# EAGLE design Connector (EAGLE 9.6.2)
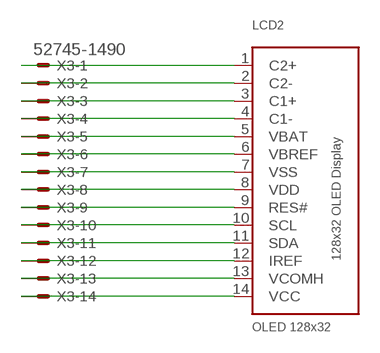
[diagram p0: schematic, sheet 1]

## Parts
LCD2  OLED 128x32  DISP_OLED_UG-2832HSWEG02  [UG-2832HSWEG02_WRAPUNDER]
X3  52745-1490  [52745-1490]

## Nets
N$52: LCD2.1(C2+) X3.1
N$53: LCD2.2(C2-) X3.2
N$54: LCD2.3(C1+) X3.3
N$55: LCD2.4(C1-) X3.4
N$56: LCD2.5(VBAT) X3.5
N$57: LCD2.6(VBREF) X3.6
N$58: LCD2.7(VSS) X3.7
N$59: LCD2.8(VDD) X3.8
N$60: LCD2.9(RES#) X3.9
N$61: LCD2.10(SCL) X3.10
N$62: LCD2.11(SDA) X3.11
N$63: LCD2.12(IREF) X3.12
N$64: LCD2.13(VCOMH) X3.13
N$65: LCD2.14(VCC) X3.14

## Library data of the parts
LCD2 = microbuilder:DISP_OLED_UG-2832HSWEG02: 128x32 I2C 0.91" Monochrome OLED Display
X3 = con-molex:52745-1490: FFC/FPC-to-Board 0.50mm (.020") SMT Top Contact Right Angle, ZIF, Style Receptacle 52745 / 52435 Source: http://www.molex.com/product/ffc/52745.html; MF: WALDOM/MOLEX; MPN: 52745-1490; OC_FARNELL: unknown; OC_NEWARK: 38C9888

## Net classes
0 default: width 0.203 mm

## Board
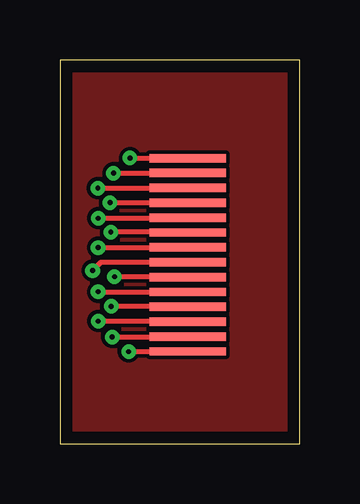
[diagram p1: board, top side]
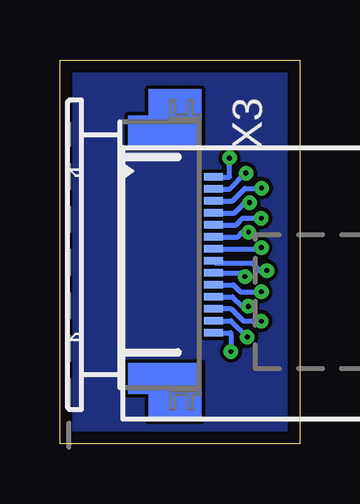
[diagram p2: board, bottom side, seen from below]

Size 10 x 16 mm. Coordinates in mm from the lower left corner, seen from the top.
Outline: 0,0 10,0 10,16 0,16 0,0
Copper layers (1*16): Top 0.035mm / dielectric 1.5mm / Bottom 0.035mm
Design rules "default *": minimum track width 6mil, minimum drill 0.35mm, track to track 6mil, track to pad 6mil, pad to pad 6mil, via to via 6mil, smd to smd 6mil, copper to edge 20mil, drill to drill 6mil, minimum pad ring 10mil, minimum via ring 8mil, stop-mask expansion 4mil, vias tented up to drill 8mil, thermal gap 10mil

### Footprints (pad centres in the part's own frame; a part is rotated, then mirrored left to right if it is on the bottom)
UG-2832HSWEG02_WRAPUNDER = smd 3.2 x 0.35 bottom: 1 -2.03,-5.3; 2 -2.03,-4.68; 3 -2.03,-4.06; 4 -2.03,-3.44; 5 -2.03,-2.82; 6 -2.03,-2.2; 7 -2.03,-1.58; 8 -2.03,-0.96; 9 -2.03,-0.34; 10 -2.03,0.28; 11 -2.03,0.9; 12 -2.03,1.52; 13 -2.03,2.14; 14 -2.03,2.76
52745-1490 = smd 0.3 x 0.8: 1 -3.25,2.5; 2 -2.75,2.5; 3 -2.25,2.5; 4 -1.75,2.5; 5 -1.25,2.5; 6 -0.75,2.5; 7 -0.25,2.5; 8 0.25,2.5; 9 0.75,2.5; 10 1.25,2.5; 11 1.75,2.5; 12 2.25,2.5; 13 2.75,2.5; 14 3.25,2.5

### Placement (x,y rotation side)
LCD2  7.37,6.6 180 bottom
X3  6.1,7.87 270 bottom

### Tracks (layer width: path | path; a pad name or v marks a point on that pad's centre or on a via)
GND
  pour Bottom: 0,0 0,16 10,16 10,0
  pour Top: 0,0 0,16 10,16 10,0
N$52  (via drill 0.2)
  Top 0.203: v2.92,11.91 5.34,11.91 LCD2.1
  Bottom 0.203: X3.1 2.92,11.12 v2.92,11.91
N$53  (via drill 0.2)
  Top 0.203: v2.23,11.28 LCD2.2
  Bottom 0.203: X3.2 2.91,10.62 2.26,11.28 v2.23,11.28
N$54  (via drill 0.2)
  Top 0.203: v1.58,10.65 5.32,10.65 LCD2.3
  Bottom 0.203: X3.3 2.81,10.12 2.29,10.64 v1.59,10.64 v1.58,10.65
N$55  (via drill 0.2)
  Top 0.203: v2.09,10.05 v2.09,10.04 LCD2.4
  Bottom 0.203: X3.4 2.72,9.62 2.31,10.03 2.1,10.03 v2.09,10.05
N$56  (via drill 0.2)
  Top 0.203: v1.6,9.4 5.31,9.4 LCD2.5
  Bottom 0.203: X3.5 2.64,9.12 2.36,9.4 v1.6,9.4
N$57  (via drill 0.2)
  Top 0.203: LCD2.6 5.32,8.82 v2.12,8.82
  Bottom 0.203: X3.6 2.58,8.62 2.39,8.81 v2.13,8.81 v2.12,8.82
N$58  (via drill 0.2)
  Top 0.203: v1.59,8.17 5.32,8.17 LCD2.7
  Bottom 0.203: X3.7 1.66,8.12 v1.6,8.18 v1.59,8.17
N$59  (via drill 0.2)
  Top 0.203: v1.37,7.21 1.72,7.56 LCD2.8
  Bottom 0.203: X3.8 3.5,7.53 1.98,7.53 1.67,7.21 v1.37,7.21
N$60  (via drill 0.2)
  Top 0.203: v2.28,6.96 5.32,6.96 LCD2.9
  Bottom 0.203: X3.9 2.44,7.12 v2.28,6.96
N$61  (via drill 0.2)
  Top 0.203: v1.59,6.33 5.33,6.33 LCD2.10
  Bottom 0.203: X3.10 2.76,6.62 2.46,6.33 v1.59,6.33
N$62  (via drill 0.2)
  Top 0.203: v2.14,5.72 5.32,5.72 LCD2.11
  Bottom 0.203: X3.11 2.79,6.12 2.39,5.71 v2.15,5.71 v2.14,5.72
N$63  (via drill 0.2)
  Top 0.203: v1.6,5.11 5.32,5.11 LCD2.12
  Bottom 0.203: v1.6,5.11 2.34,5.11 2.87,5.63 X3.12
N$64  (via drill 0.2)
  Top 0.203: v2.18,4.45 5.32,4.45 LCD2.13
  Bottom 0.203: X3.13 2.86,5.12 v2.18,4.45
N$65  (via drill 0.2)
  Top 0.203: v2.87,3.83 LCD2.14
  Bottom 0.203: X3.14 2.87,4.62 v2.87,3.83